# Altium schematic sheet TIDA-01485_Page3.SchDoc
size 431 x 279 mm; Date: Not shown in title block; ApprovedBy: Not shown in title block; CheckedBy: Not shown in title block; Author: Not shown in title block; CompanyName: Not shown in title block; DrawnBy: Manu; Engineer: Not shown in title block; Organization: Not shown in title block; Address1: Not shown in title block; Address2: Not shown in title block; Address3: Not shown in title block; Address4: Not shown in title block; DocumentNumber: 1; Revision: Use project parameter SCH_Rev; SheetNumber: 4; SheetTotal: 5; PageSetup: Record=PageOptions|CenterHorizontal=True|CenterVertical=True|PrintScale=1.00|XCorrection=1.00|YCorrection=1.00|PrintKind=0|BorderSize=5000000|LeftOffset=0|BottomOffset=0|Orientation=2|PaperLength=1000|PaperWidth=1000|Scale=100|PaperSource=15|PrintQuality=600|MediaType=1|DitherType=10|PaperKind=Letter|PrintScaleMode=1; CurrentTime: Not shown in title block; CurrentDate: Not shown in title block; Time: Not shown in title block; DocumentFullPathAndName: Not shown in title block; DocumentName: Not shown in title block; ModifiedDate: Not shown in title block; ImagePath: Not shown in title block
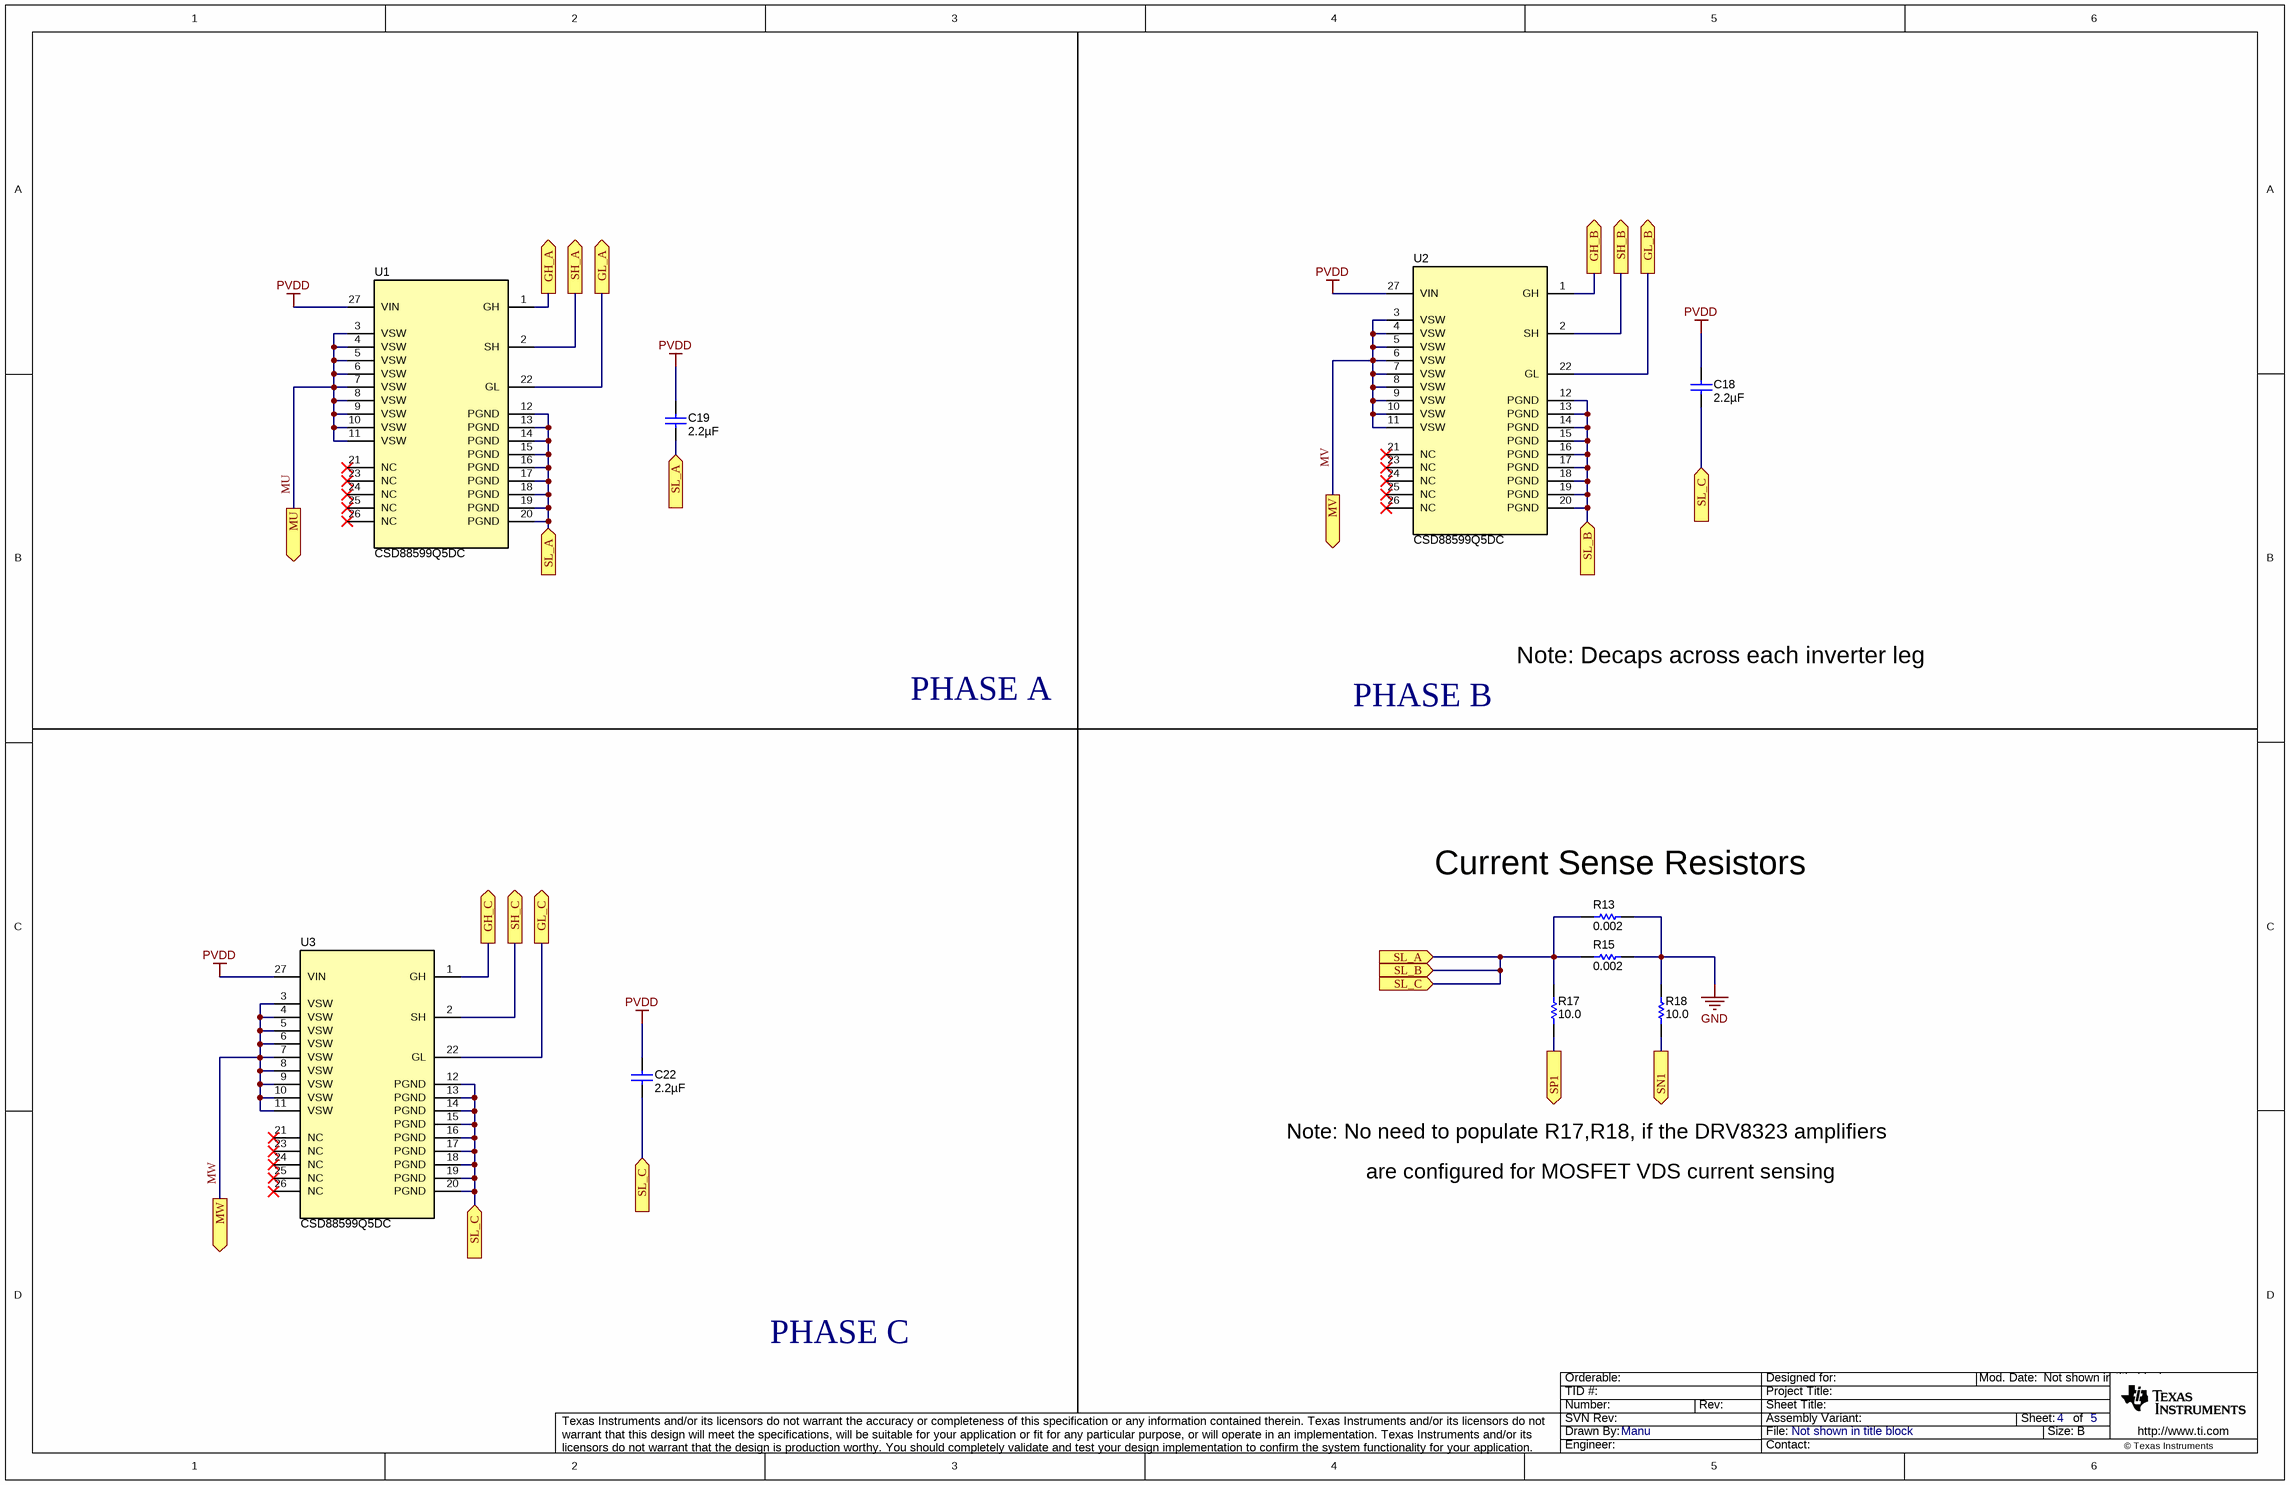
[diagram p0: TIDA-01485_Page3.SchDoc]

## Parts
C18  ValueDisplayed: 2.2µF  [1210]  (hidden comment: GRM32ER72A225KA35L)
C19  ValueDisplayed: 2.2µF  [1210]  (hidden comment: GRM32ER72A225KA35L)
C22  ValueDisplayed: 2.2µF  [1210_270]  (hidden comment: GRM32ER72A225KA35L)
R13  ValueDisplayed: 0.002  [CRE2512-R1_R4]  (hidden comment: CRE2512-FZ-R002E-3)
R15  ValueDisplayed: 0.002  [CRE2512-R1_R4]  (hidden comment: CRE2512-FZ-R002E-3)
R17  ValueDisplayed: 10.0  [0402]  (hidden comment: RMCF0402JT10R0)
R18  ValueDisplayed: 10.0  [0402]  (hidden comment: RMCF0402JT10R0)
U1  CSD88599Q5DC  [DMM0022A]
U2  CSD88599Q5DC  [DMM0022A]
U3  CSD88599Q5DC  [DMM0022A]

## Ports
GH_A (out), GH_B (out), GH_C (out), GL_A (out), GL_B (out), GL_C (out), MU (out), MV (out), MW (out), SH_A (out), SH_B (out), SH_C (out), SL_A (in), SL_B (in), SL_C (in), SN1 (out), SP1 (out)

## Nets
GND: R13.2 R15.2 R18.2
PVDD: C18.1 C19.1 C22.1 U1.27(VIN) U2.27(VIN) U3.27(VIN)
GH_A: U1.1(GH) ; port GH_A
GH_B: U2.1(GH) ; port GH_B
GH_C: U3.1(GH) ; port GH_C
GL_A: U1.22(GL) ; port GL_A
GL_B: U2.22(GL) ; port GL_B
GL_C: U3.22(GL) ; port GL_C
MU: U1.3(VSW) U1.4(VSW) U1.5(VSW) U1.6(VSW) U1.7(VSW) U1.8(VSW) U1.9(VSW) U1.10(VSW) U1.11(VSW) ; port MU
MV: U2.3(VSW) U2.4(VSW) U2.5(VSW) U2.6(VSW) U2.7(VSW) U2.8(VSW) U2.9(VSW) U2.10(VSW) U2.11(VSW) ; port MV
MW: U3.3(VSW) U3.4(VSW) U3.5(VSW) U3.6(VSW) U3.7(VSW) U3.8(VSW) U3.9(VSW) U3.10(VSW) U3.11(VSW) ; port MW
SH_A: U1.2(SH) ; port SH_A
SH_B: U2.2(SH) ; port SH_B
SH_C: U3.2(SH) ; port SH_C
SL_A: C18.2 C19.2 C22.2 R13.1 R15.1 R17.2 U1.12(PGND) U1.13(PGND) U1.14(PGND) U1.15(PGND) U1.16(PGND) U1.17(PGND) U1.18(PGND) U1.19(PGND) U1.20(PGND) U2.12(PGND) U2.13(PGND) U2.14(PGND) U2.15(PGND) U2.16(PGND) U2.17(PGND) U2.18(PGND) U2.19(PGND) U2.20(PGND) U3.12(PGND) U3.13(PGND) U3.14(PGND) U3.15(PGND) U3.16(PGND) U3.17(PGND) U3.18(PGND) U3.19(PGND) U3.20(PGND) ; port SL_A, port SL_B, port SL_C
SN1: R18.1 ; port SN1
SP1: R17.1 ; port SP1

Not connected (* = marked no-connect by the designer): U1 21(NC)* 23(NC)* 24(NC)* 25(NC)* 26(NC)*; U2 21(NC)* 23(NC)* 24(NC)* 25(NC)* 26(NC)*; U3 21(NC)* 23(NC)* 24(NC)* 25(NC)* 26(NC)*

## Notes on the sheet
- PHASE A
- Note: Decaps across each inverter leg
- PHASE B
- (near R13) Current Sense Resistors
- Note: No need to populate R17,R18, if the DRV8323 amplifiers
- are configured for MOSFET VDS current sensing
- PHASE C
- Drawn By:
- SVN Rev:
- Number:
- TID #:
- Orderable:
- Rev:
- Sheet Title:
- File:
- Project Title:
- Designed for:
- Assembly Variant:
- Mod. Date:
- Sheet:
- Size:
- of
- B
- http://www.ti.com
- Texas Instruments and/or its licensors do not warrant the accuracy or completeness of this specification or any information contained therein. Texas Instruments and/or its licensors do not warrant that this design will meet the specifications, will be suitable for your application or fit for any particular purpose, or will operate in an implementation. Texas Instruments and/or its licensors do not warrant that the design is production worthy. You should completely validate and test your design implementation to confirm the system functionality for your application.
- Engineer:
- Contact:
- © Texas Instruments

## Library data of the parts
C18 = GRM32ER72A225KA35L: CAP, CERM, 2.2 µF, 100 V, +/- 10%, X7R, 1210; Manufacturer: MuRata; Polarized: N; CompType: Capacitor; Value: 2.2uF; U/M: EA; Cap_F: 0.0000022; Tolerance_%: 10; ESR_ohm: 0.007; Value1: 0.007 ohm; VDC_V: 100; Value2: 100V; IRMS_A: 4.4; TaMin_C: -55; TaMax_C: 125; AEC Category: Q200; SizeArea_mm2: 8; SizeAreaWB_mm2: 14.7; SizeX_mm: 3.2; SizeY_mm: 2.5; SizeZ_mm: 2.7; SymbolVersion: 2008-07-09; PartNumber: GRM32ER72A225KA35L; PackageReference: 1210; RoHS: Y; MountType: SMT; Technology: Ceramic; TempCo: X7R; Cap_Case: 1210; Published: 2008-06-19; Publisher: Texas Instruments; LatestRevisionDate: 2016-08-24; ComponentLink1Description: Datasheet link; ComponentLink1URL: http://search.murata.co.jp/Ceramy/PnsearchViewAction.do?HnOFG=ON&HnNFG=ON&SEL_CNT=50&sLang=en&sKey=GRM32ER72A225KA35L&x=9&y=9&search=startwith; Supplier 1: Digi-Key; Supplier Part Number 1: 490-3385-1-ND; Supplier 2: Mouser; Supplier Part Number 2: 81-GRM32ER72A225KA35; Supplier 3: Farnell; Supplier Part Number 3: 1735547; AEC Qualified: ?
C19 = GRM32ER72A225KA35L: CAP, CERM, 2.2 µF, 100 V, +/- 10%, X7R, 1210; Manufacturer: MuRata; Polarized: N; CompType: Capacitor; Value: 2.2uF; U/M: EA; Cap_F: 0.0000022; Tolerance_%: 10; ESR_ohm: 0.007; Value1: 0.007 ohm; VDC_V: 100; Value2: 100V; IRMS_A: 4.4; TaMin_C: -55; TaMax_C: 125; AEC Category: Q200; SymbolVersion: 2008-07-09; PartNumber: GRM32ER72A225KA35L; PackageReference: 1210; RoHS: Y; MountType: SMT; Technology: Ceramic; TempCo: X7R; Cap_Case: 1210; Published: 2008-06-19; Publisher: Texas Instruments; LatestRevisionDate: 2016-01-08; ComponentLink1Description: Datasheet link; ComponentLink1URL: http://search.murata.co.jp/Ceramy/PnsearchViewAction.do?HnOFG=ON&HnNFG=ON&SEL_CNT=50&sLang=en&sKey=GRM32ER72A225KA35L&x=9&y=9&search=startwith; Supplier 1: Digi-Key; Supplier Part Number 1: 490-3385-1-ND; Supplier 2: Mouser; Supplier Part Number 2: 81-GRM32ER72A225KA35; Supplier 3: Farnell; Supplier Part Number 3: 1735547; AEC Qualified: ?
C22 = GRM32ER72A225KA35L: CAP, CERM, 2.2 µF, 100 V, +/- 10%, X7R, 1210; Manufacturer: MuRata; Polarized: N; CompType: Capacitor; Value: 2.2uF; U/M: EA; Cap_F: 0.0000022; Tolerance_%: 10; ESR_ohm: 0.007; Value1: 0.007 ohm; VDC_V: 100; Value2: 100V; IRMS_A: 4.4; TaMin_C: -55; TaMax_C: 125; Cap_Case: 1210; AEC Category: Q200; SizeArea_mm2: 8; SizeAreaWB_mm2: 14.7; SizeX_mm: 3.2; SizeY_mm: 2.5; SizeZ_mm: 2.7; SymbolVersion: 2008-07-09; PartNumber: GRM32ER72A225KA35L; PackageReference: 1210; RoHS: Y; MountType: SMT; Technology: Ceramic; TempCo: X7R; Published: 2008-06-19; Publisher: Texas Instruments; LatestRevisionDate: 2016-08-24; ComponentLink1Description: Datasheet link; ComponentLink1URL: http://search.murata.co.jp/Ceramy/PnsearchViewAction.do?HnOFG=ON&HnNFG=ON&SEL_CNT=50&sLang=en&sKey=GRM32ER72A225KA35L&x=9&y=9&search=startwith; Supplier 1: Digi-Key; Supplier Part Number 1: 490-3385-1-ND; Supplier 2: Mouser; Supplier Part Number 2: 81-GRM32ER72A225KA35; Supplier 3: Farnell; Supplier Part Number 3: 1735547; AEC Qualified: ?
R13 R15 = CRE2512-FZ-R002E-3: RES, 0.002, 1%, 3 W, AEC-Q200 Grade 0, 2512; Manufacturer: Bourns; CompType: Resistor; Value: 0.002; Value_Code: 2L000; Tolerance_%: 1; Power_W: 3; Value2: 3W; TempCo: 50 ppm/C; U/M: EA; AEC Category: Q200; AEC Qualified: Y; AEC Grade: 0; SizeArea_mm2: 21.6075; SizeX_mm: 6.45; SizeY_mm: 3.35; SizeZ_mm: 0.9; SymbolVersion: 2009-05-29; PartNumber: CRE2512-FZ-R002E-3; PackageReference: 2512; RoHS: Y; Res_ohm: 0.002; Value1: 1%; MountType: SMT; Technology: Metal Film; Published: 2008-06-26; Publisher: Texas Instruments; LatestRevisionDate: 2017-06-11; ComponentLink1Description: Datasheet link; ComponentLink1URL: http://www.bourns.com/docs/Product-Datasheets/CRE.pdf; Supplier 1: Digi-Key; Supplier Part Number 1: CRE2512-FZ-R002E-3CT-ND; Supplier 2: Newark; Supplier Part Number 2: 78X4868; Supplier 3: Mouser; Supplier Part Number 3: 652-CRE2512FZR002E-3
R17 R18 = RMCF0402JT10R0: RES, 10.0, 1%, 0.063 W, AEC-Q200 Grade 0, 0402; Manufacturer: Stackpole Electronics Inc; CompType: Resistor; Res_ohm: 10; Value: 10.0; Value_Code: 10R0; Tolerance_%: 1; Power_W: 0.063; Value2: 0.063W; TempCo: 100 ppm/C; EIA_Code: E96; U/M: EA; AEC Category: Q200; AEC Qualified: Y; AEC Grade: 0; SizeArea_mm2: 0.5; SizeZ_mm: 0.6; SymbolVersion: 2009-05-29; PartNumber: RMCF0402JT10R0; PackageReference: 0402; RoHS: Y; Value1: 1%; MountType: SMT; Technology: Thick Film; Published: 2008-06-26; Publisher: Texas Instruments; LatestRevisionDate: 2017-06-12; ComponentLink1Description: Datasheet link; ComponentLink1URL: https://www.seielect.com/Catalog/SEI-RMCF_RMCP.pdf; Supplier 1: Digi-Key; Supplier Part Number 1: RMCF0402JT10R0CT-ND; SizeX_mm: 1; SizeY_mm: 0.5
U1-U3 = CSD88599Q5DC: 60 V Half-Bridge NexFE Power Block, DMM0022A; Alternate PartNumber: CSD88599Q5DCT; Manufacturer: Texas Instruments; SymbolCreator: Altium; SizeArea_mm2: 30; SizeAreaWB_mm2: 56; SizeX_mm: 5; SizeY_mm: 6; SizeZ_mm: 1.05; CompType: IC; U/M: EA; SymbolVersion: 2016-08-25; PartNumber: CSD88599Q5DC; PackageReference: DMM0022A; PackageDescription: LSON-CLIP-27; MountType: SMT; ComponentLink1Description: Datasheet Link; ComponentLink1URL: https://sps06.itg.ti.com/sites/KMS/crossdivteams/altium/docs/ComponentDatasheets/CSD88599Q5DC.pdf; RoHS: Y; Publisher: Texas Instruments; LatestRevisionDate: 2016-08-27; Alternate Manufacturer: Texas Instruments